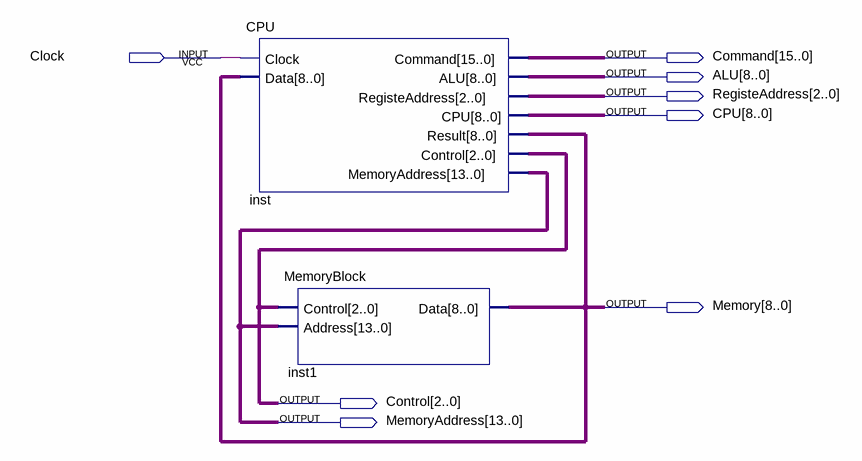
[diagram p0: schematic sheet]
// Quartus schematic MainScheme.bdf as structural Verilog: 2 symbols, 8 pins
module MainScheme (
  input  Clock,
  output [15:0] Command,
  output [8:0] ALU,
  output [2:0] RegisteAddress,
  output [8:0] CPU,
  output [8:0] Memory,
  output [2:0] Control,
  output [13:0] MemoryAddress
);

  CPU inst (
    .Clock(Clock), .Data(Memory), .Command(Command), .ALU(ALU), .RegisteAddress(RegisteAddress), .CPU(CPU),
    .Result(Memory), .Control(Control), .MemoryAddress(MemoryAddress));
  MemoryBlock inst1 (.Control(Control), .Address(MemoryAddress), .Data(Memory));
endmodule
